# Altium schematic sheet Power.SchDoc
size A4; SheetNumber: 4; SheetTotal: 5
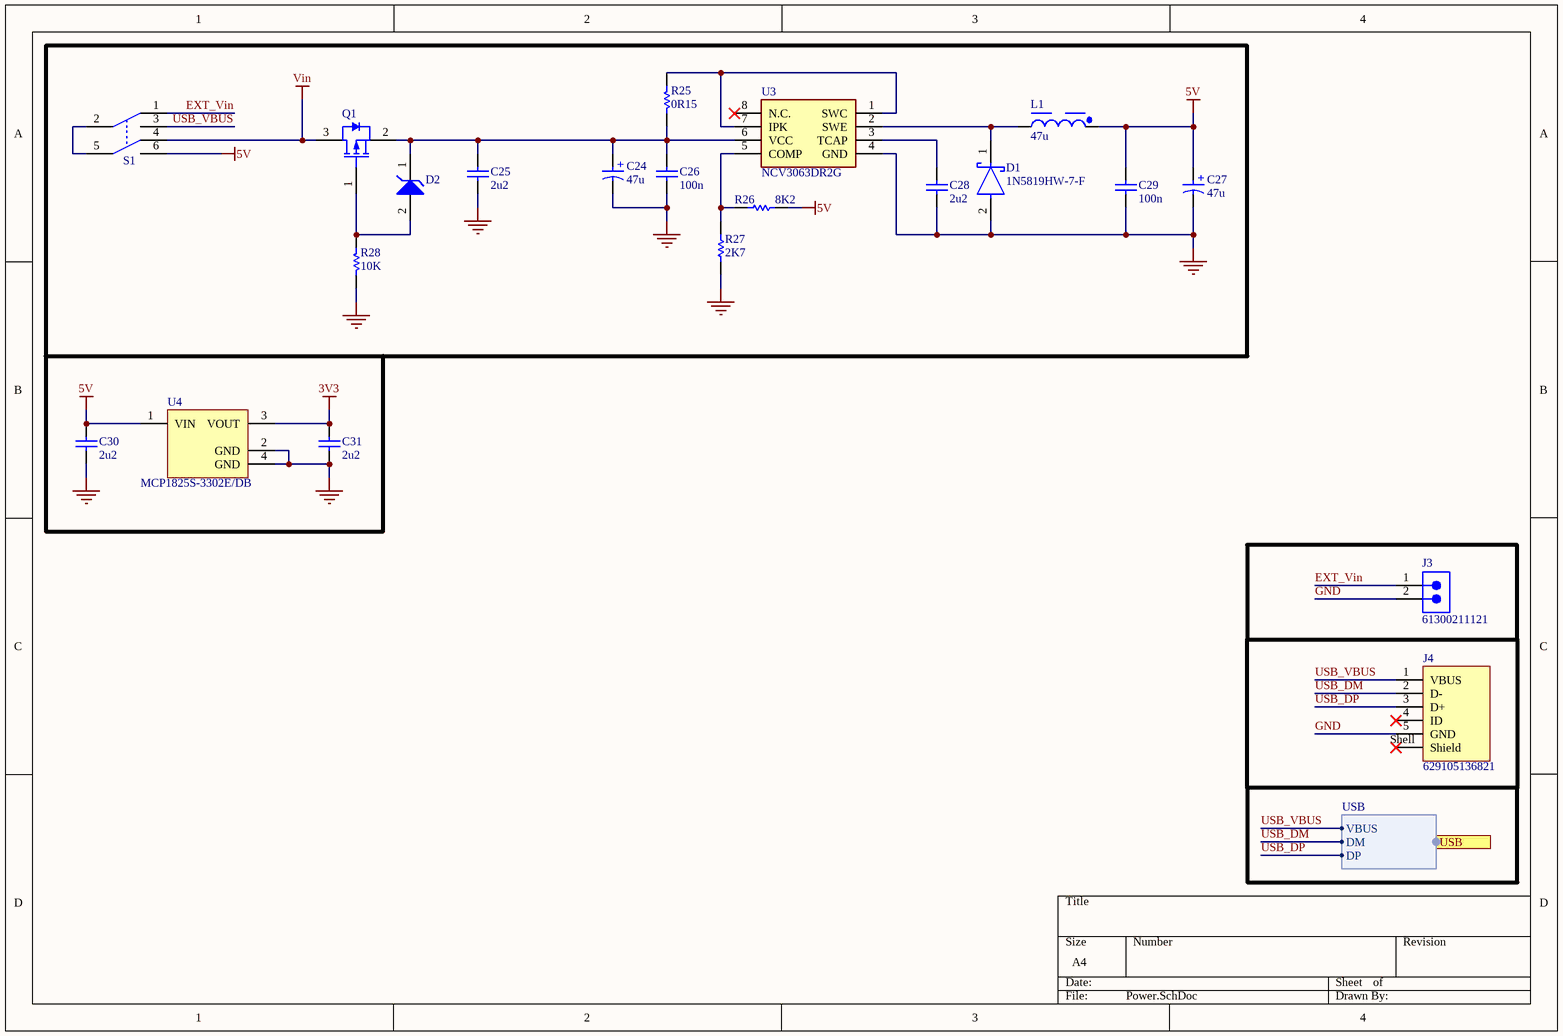
[diagram p0: Power.SchDoc]

## Parts
C24  47u  [WCAP-ASLI_D6.3H7.7]
C25  2u2  [1206]
C26  100n  [0603]
C27  47u  [WCAP-ASLI_D6.3H7.7]
C28  2u2  [1206]
C29  100n  [0603]
C30  2u2  [1206]
C31  2u2  [1206]
D1  1N5819HW-7-F  [FP-SOD123-IPC_A]
D2  SZMMSZ4687T1G  [ONSC-SOD-123-2-425-04_V]  (value not drawn)
J3  61300211121  [61300211121]
J4  629105136821  [629105136821]
L1  47u  [WE-HEPC_6030]
Q1  NTRV4101PT1G  [ONSC-SOT-23-3-318-08_V]  (value not drawn)
R25  0R15  [1206]
R26  8K2  [0603]
R27  2K7  [0603]
R28  10K  [0603]
S1  OS202013MT8QN1  [OS202013MT8QN1]  (value not drawn)
U3  NCV3063DR2G  [SOIC127P600X175-8N]
U4  MCP1825S-3302E/DB  [SOT-223-DB3_N]

## Ports
USB (harness USB, see Main[2A], Controller[4D])

## Harnesses
USB: VBUS, DM, DP

## Nets
3V3: C31.2 U4.3(VOUT)
5V: C27.1(P) C29.2 C30.2 L1.1 R26.2 S1.6(NO_2) U4.1(VIN)
GND: C24.2(N) C25.1 C26.1 C27.2(N) C28.1 C29.1 C30.1 C31.1 D1.2(A) J3.2 J4.5(GND) R27.1 R28.1 U3.4(GND) U4.2(GND) U4.4(GND)
Vin: Q1.3(D) S1.4(NC_2)
EXT_Vin: J3.1 S1.1(NC_1)
USB_DM: J4.2(D-) ; port USB.DM
USB_DP: J4.3(D+) ; port USB.DP
USB_VBUS: J4.1(VBUS) S1.3(NO_1) ; port USB.VBUS
NetC24_1: C24.1(P) C25.2 C26.2 D2.1(K) Q1.2(S) R25.1 U3.6(VCC)
NetC28_2: C28.2 U3.3(TCAP)
NetD1_1: D1.1(C) L1.2 U3.2(SWE)
NetD2_2: D2.2(A) Q1.1(G) R28.2
NetR25_2: R25.2 U3.1(SWC) U3.7(IPK)
NetR26_1: R26.1 R27.2 U3.5(COMP)
NetS1_2: S1.2(COM_1) S1.5(COM_2)

Not connected (* = marked no-connect by the designer): J4 4(ID)* Shell(Shield)*; U3 8(N.C.)*

## Notes on the sheet
- (in symbol CMP-03913-53914620-1) +

## Library data of the parts
C24 C27 = CMP-03913-53914620-1: 865080645012 WCAP-ASLI Aluminum Electrolytic Capacitors; Life (Hours): 2000hours; Voltage Rating: 50V; Impedance: 700mΩ; Capacitance: 47µF; Insulation Resistance: 2.12766MΩ; Leakage Current: 23.5µA; ESR (Equivalent Series Resistance): 540.449mΩ; Ripple Current (AC): 230mA; Case/Package: Radial; Length: 7.7mm; Diameter: 6.3mm; Max Operating Temperature: 105°C; REACH SVHC: Unknown; RoHS: Compliant; Voltage Rating (DC): 50V; Packaging: Cut Tape; Min Operating Temperature: -55°C; Width: 6.6mm; Height: 7.7mm; NexarPartId: 53914620; Ripple Current: 230mA
C25 C28 C30 C31 = C1206C225K5RACAUTO7210: Capacitor 50V / 1206; Value: 2.2u
C26 C29 = GA0603Y104KXAAC31G: Capacitor 50V / 0603; Value: 100n
D1 = CMP-0303-00003-3: DIODE SCHOTTKY 40V 1A SOD123; Forward Voltage: 450mV; Capacitance: 110pF; Max Forward Surge Current (Ifsm): 25A; Peak Reverse Current: 50uA; Polarity: Standard; Element Configuration: Single; Max Power Dissipation: 450mW; Min Operating Temperature: -65°C; Package Quantity: 3000; Contact Plating: Tin; Weight: 0.000353oz; Max Repetitive Reverse Voltage (Vrrm): 40V; Max Reverse Voltage (DC): 40V; Height: 1.25mm; Average Rectified Current: 1A; Width: 1.7mm; Case/Package: SOD-123-2; Lead Free: Lead Free; Max Operating Temperature: 125°C; Current Rating: 1A; Termination: SMD/SMT; Forward Current: 1A; Radiation Hardening: No; Number of Pins: 2; Length: 2.85mm; Voltage Rating (DC): 40V; REACH SVHC: No SVHC; Peak Non-Repetitive Surge Current: 25A; Packaging: Tape and Reel; Output Current: 1A
D2 = CMP-1060-00576-1: Zener Voltage Regulator, 500 mW, 2-Pin SOD-123, Pb-Free, Tape and Reel; Manufacturer: On Semiconductor; P Max (W): 0.5; VZ Typ (V): 4.3; Packing: Tape and Reel; PackageVersion: Rev. G, 10/2009; PackageDescription: 2-Pin SOD, Body 1.6 x 2.69 mm; PartNumber: SZMMSZ4687T1G; ComponentLink3URL: http://www.onsemi.com/pub_link/Collateral/425-04.PDF; Mounting Technology: Surface Mount; ComponentLink3Description: Package Specification; ComponentLink1Description: Manufacturer URL; RoHS: Pb-Free; PackageReference: SOD-123-2-425-04; ComponentLink1URL: http://www.onsemi.com/; ComponentLink2Description: Datasheet; DatasheetVersion: Rev. 9; ComponentLink2URL: http://www.onsemi.com/pub_link/Collateral/MMSZ4678T1-D.PDF
J3 = CMP-1712-00002-6: NexarPartId: 20081794; Number of Contacts: 2; Pitch: 2.54mm; Connector Type: Male Pin; Voltage Rating: 250V; Current Rating: 3A; Gender: Male; Contact Resistance: 20mΩ; Height: 8.94mm; Lead Free: Lead Free; Number of Pins: 2; Termination: Through Hole; RoHS: Compliant; Lead Pitch: 2.54mm; REACH SVHC: No SVHC; Housing Material: PBT; Contact Mating Length: 5.9944mm; Min Operating Temperature: -40°C; Orientation: Vertical; Contact Material: Copper; Contact Gender: Male; Max Operating Temperature: 125°C; Number of Rows: 1; Number of Positions: 2; Packaging: Bulk; Contact Plating: Gold; Mount: Through Hole; Color: Black; Operating Supply Voltage: 250V
J4 = CMP-1502-03253-2: NexarPartId: 19991173; Insulation Resistance: 1GΩ; Contact Resistance: 30mΩ; Number of Contacts: 5; Number of Ports: 1; Gender: Receptacle; Current Rating: 1A; Connector Type: USB; Voltage Rating: 30V; USB Standard: USB 2.0; Plating: Nickel; Max Operating Temperature: 105°C; Orientation: Horizontal; Height: 2.9mm; Termination: Solder; Min Operating Temperature: -40°C; Number of Pins: 5; Flammability Rating: UL94 V-0; Lead Free: Lead Free; Packaging: Tape and Reel; Contact Plating: Gold; RoHS: Compliant; Mount: Horizontal, Surface Mount; Color: Black; REACH SVHC: Unknown; Operating Supply Voltage: 30V; Contact Material: Copper; Number of Positions: 5; Length: 5.9mm
L1 = CMP-03913-133884705-1: 74408063470 Power Ind, 47Uh, Shielded, 0.8A Rohs Compliant: Yes; Inductance: 47µH; Current Rating: 800mA; DC Resistance (DCR): 365mΩ; Ambient Temperature Range Low: -40°C; NexarPartId: 133884705; Height: 2.85mm; RoHS: Compliant; Ambient Temperature Range High: 85°C; Length: 5.9mm; Max Operating Temperature: 125°C; Width: 5.9mm; Saturation Current: 800mA; Min Operating Temperature: -40°C
Q1 = CMP-1058-00744-1: Trench Power MOSFET, -20 V, Single P-Channel, 3-Pin SOT-23, Pb-Free, Tape and Reel; Manufacturer: On Semiconductor; Crss Typ (pF): 75; V(BR)DSS Min (V): 20; Coss Typ (pF): 100; Ciss Typ (pF): 675; VGS Max (V): 8; Channel Polarity: P Channel; ID Max (A): 3.2; VGS(th) Max (V): 1.2; Qrr Typ (nC): 1008; ComponentLink2URL: http://www.onsemi.cn/pub_link/Collateral/NTR4101P-D.PDF; PartNumber: NTRV4101PT1G; ComponentLink1Description: Manufacturer URL; Packing: Tape and Reel; ComponentLink1URL: http://www.onsemi.com/; PackageReference: SOT-23-3-318-08; ComponentLink3URL: http://www.onsemi.cn/pub_link/Collateral/318-08.PDF; PackageVersion: Rev. AP, 11/2009; Package Type: SOT-23-3; Configuration: Single; ComponentLink3Description: Package Specification; Mounting Technology: Surface Mount; RoHS: Pb-Free; ComponentLink2Description: Datasheet; PackageDescription: 3-Pin Small Outline Transistor, Body 2.92 x 1.3 mm, Pitch 0.95 mm; DatasheetVersion: Rev. 9
R25 = WFC1206R1500FE66: Resistor 0.5W; Value: 0R15
R26 = CRCW06038K20FKEA: Resistor 0.1W; Value: 8K2
R27 = CRCW06032K70FKEA: Resistor 0.1W; Value: 2K7
R28 = CRCW060310K0FKEA: Resistor 0.1W; Value: 10K
S1 = OS202013MT8QN1: Switch; Manufacturer_Name: C & K COMPONENTS; Datasheet Link: https://www.ckswitches.com/media/1428/os.pdf; Height: 11mm; Manufacturer_Part_Number: OS202013MT8QN1; Mouser Part Number: 611-OS202013MT8QN1; Mouser Price/Stock: https://www.mouser.co.uk/ProductDetail/CK/OS202013MT8QN1?qs=WtljUlYws5RhlgqE4KzYAw%3D%3D; Arrow Part Number: OS202013MT8QN1; Arrow Price/Stock: https://www.arrow.com/en/products/os202013mt8qn1/ck?region=europe
U3 = NCV3063DR2G: Integrated Circuit; Manufacturer_Name: onsemi; Datasheet Link: https://www.onsemi.com/pub/Collateral/NCP3063-D.PDF; Height: 1.75mm; Manufacturer_Part_Number: NCV3063DR2G; Mouser Part Number: 863-NCV3063DR2G; Arrow Part Number: NCV3063DR2G; Arrow Price/Stock: https://www.arrow.com/en/products/ncv3063dr2g/on-semiconductor
U4 = CMP-0136-00458-1: 500 mA, Low Voltage, Low Quiescent Current LDO Regulator, 3-Pin SOT-223, Extended Temperature; PackageReference: SOT-223-DB3; PackageDescription: 3-Lead Plastic Small Outline Transistor (DB) [SOT-223]; PackageVersion: revBB, Aug-2009; DatasheetVersion: revB, Feb-2008